# EasyEDA Pro project display_module.epro

# Schematic Schematic
Board Name: HV Display; Create Date: 2025-05-05; Page Name: P1; Project Name: HV Display; Schematic Name: Schematic; Update Date: 2025-05-05; Company: Halo Vision; Drawn: Kahu Hutton; Page Size: A4; Part Number: 002; Reviewed: Kahu Hutton; Version: V0.3
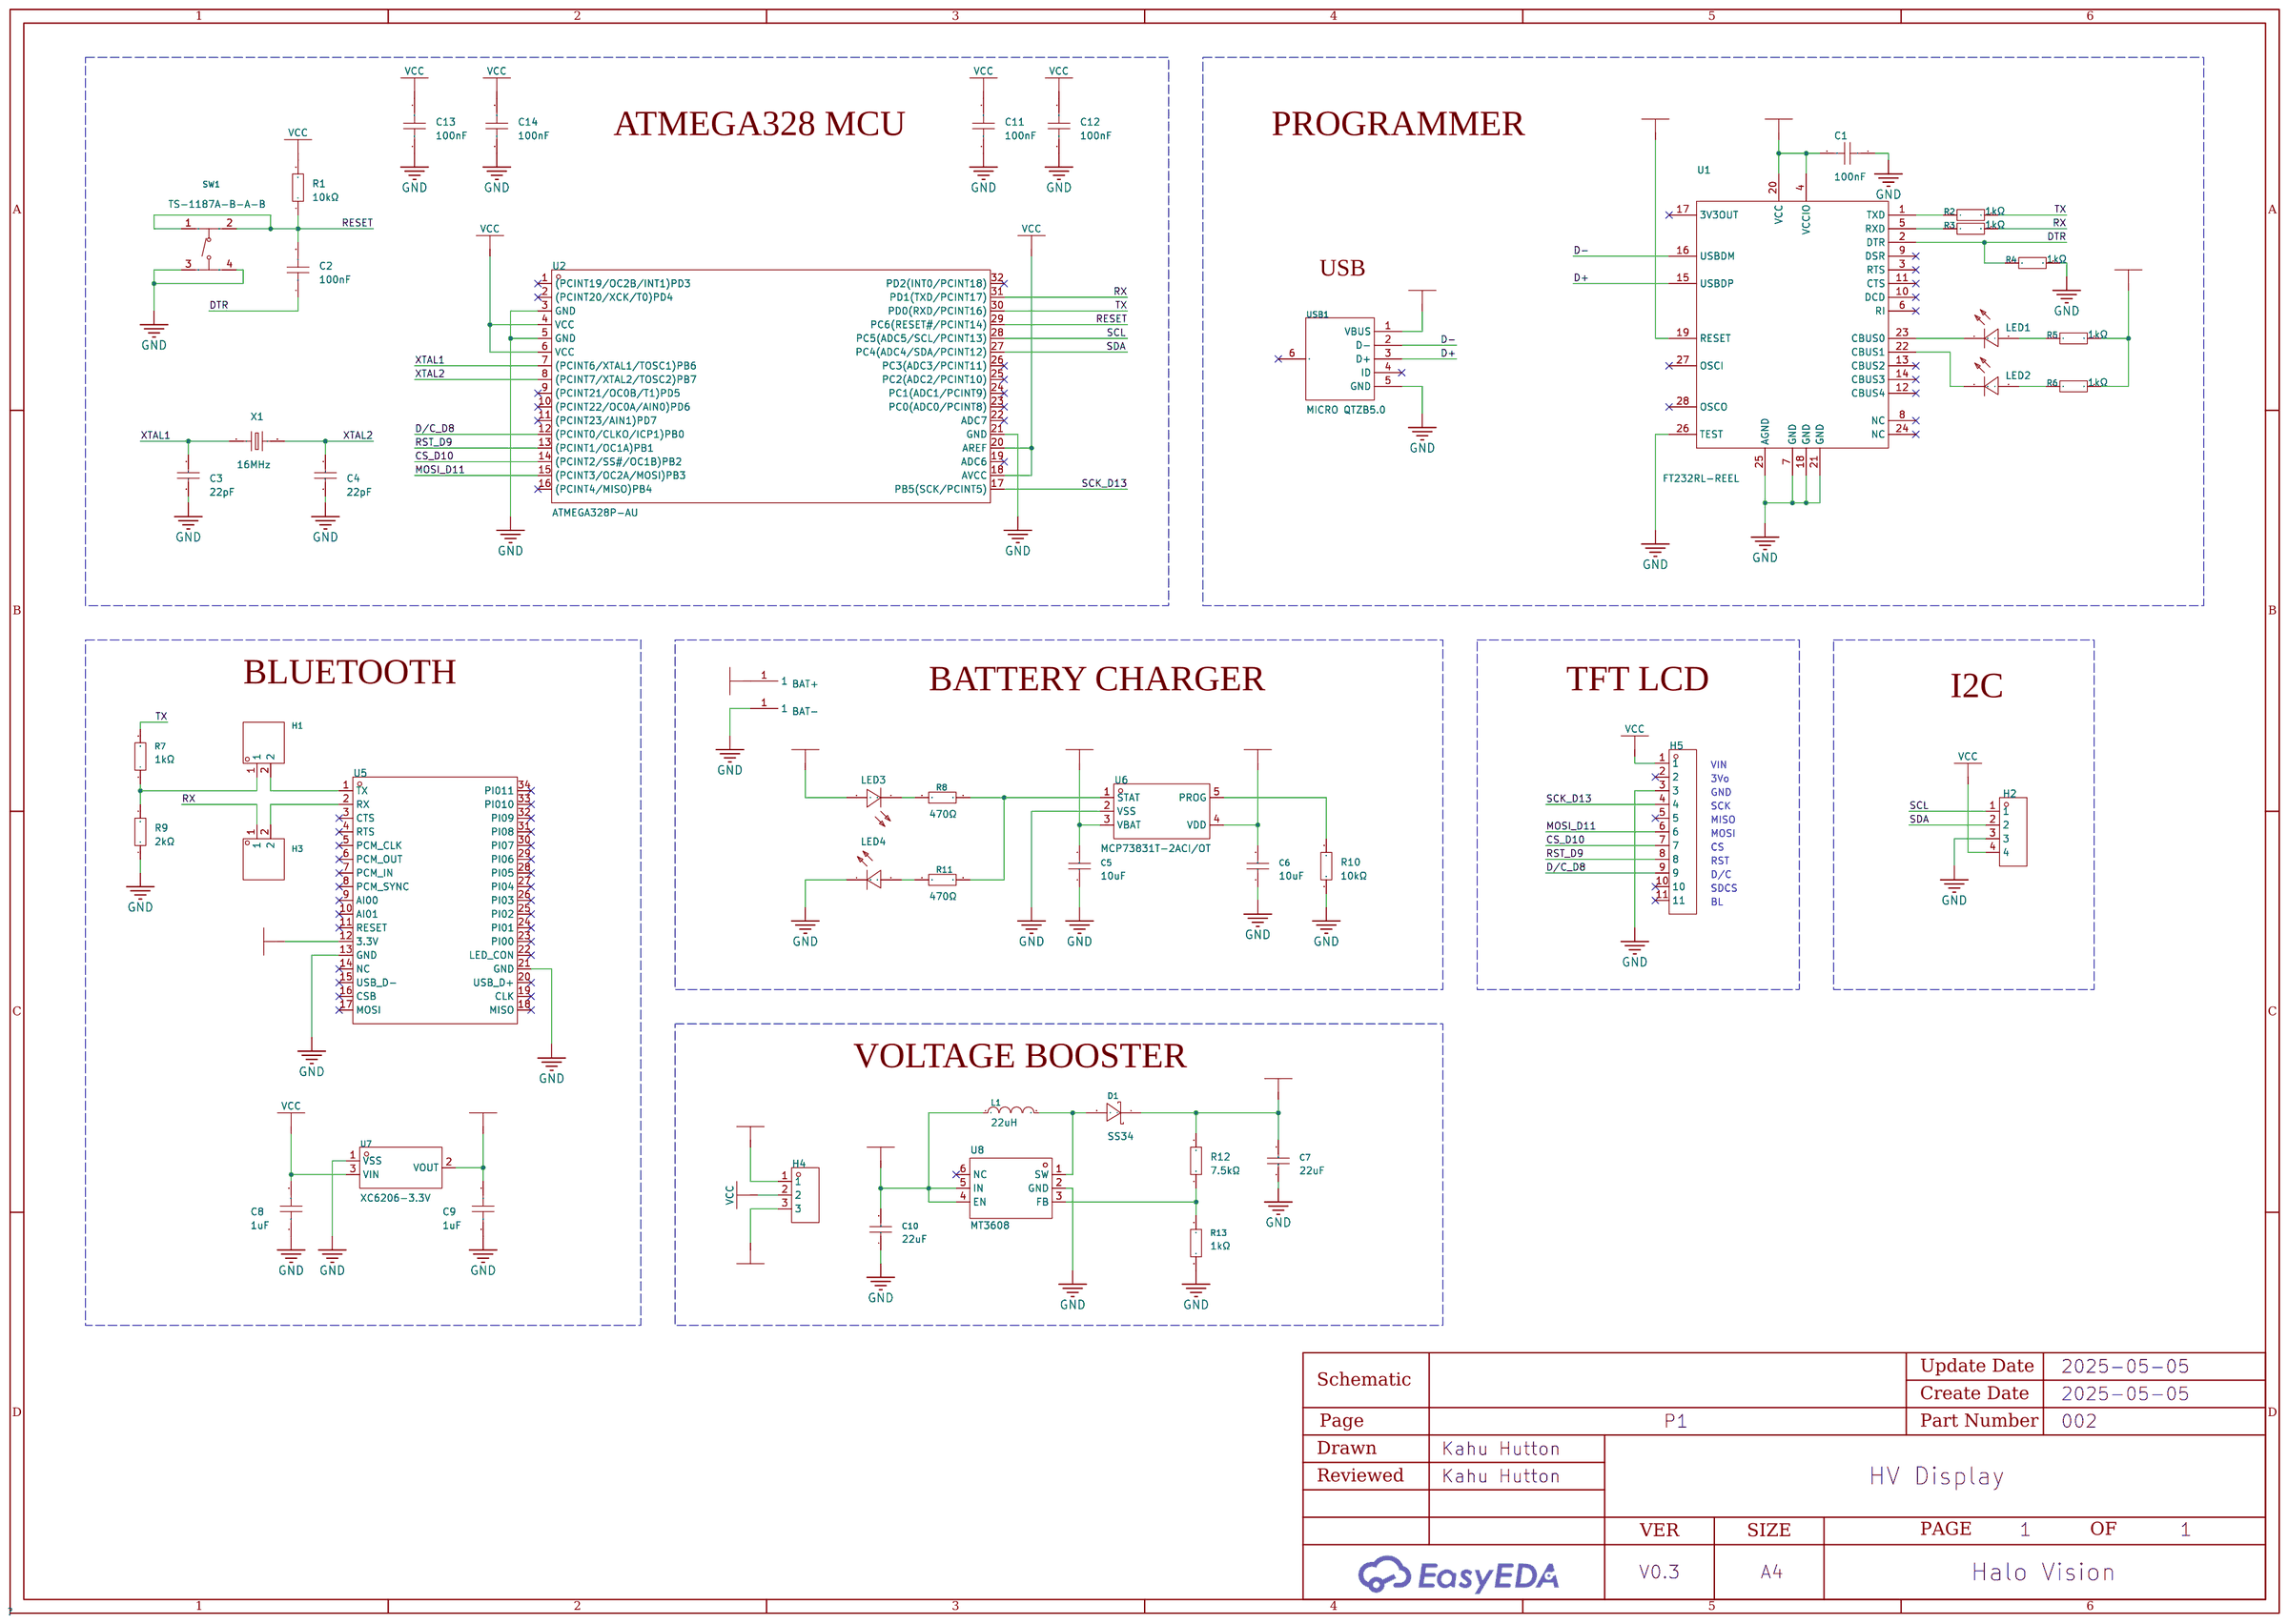
[diagram p0: schematic sheet]

## Parts
C1  100nF  [C0402]
C2  100nF  [C0402]
C3  22pF  [C0402]
C4  22pF  [C0402]
C5  10uF  [C0402]
C6  10uF  [C0402]
C7  22uF  [C1812]
C8  1uF  [C0402]
C9  1uF  [C0402]
C10  22uF  [C1812]
C11  100nF  [C0402]
C12  100nF  [C0402]
C13  100nF  [C0402]
C14  100nF  [C0402]
D1  SS34  [SMA_L4.3-W2.6-LS5.2-RD]
H1  -  [HDR-TH_2P-P2.54-V-M-1]
H2  -  [HDR-TH_4P-P2.54-V-M]
H3  -  [HDR-TH_2P-P2.54-V-M-1]
H4  -  [HDR-TH_3P-P2.54-V-M]
H5  -  [HDR-TH_11P-P2.54-V-M]
L1  22uH  [IND-SMD_L7.0-W6.8]
LED1  TJ-S1005SW4TGLC2R-A5  [LED0402-RD]
LED2  TJ-S1005SW4TGLC2R-A5  [LED0402-RD]
LED3  TJ-S1005SW4TGLC2R-A5  [LED0402-RD]
LED4  TJ-S1005SW4TGLC7K-A5  [LED0402-RD_GREEN]
R1  10kΩ  [R0402]
R2  1kΩ  [R0402]
R3  1kΩ  [R0402]
R4  1kΩ  [R0402]
R5  1kΩ  [R0402]
R6  1kΩ  [R0402]
R7  1kΩ  [R0402]
R8  470Ω  [R0402]
R9  2kΩ  [R0402]
R10  10kΩ  [R0402]
R11  470Ω  [R0402]
R12  7.5kΩ  [R0402]
R13  1kΩ  [R0402]
SW1  TS-1187A-B-A-B  [SW-SMD_4P-L5.1-W5.1-P3.70-LS6.5-TL-2]
U1  FT232RL-REEL  [SSOP-28_L10.2-W5.3-P0.65-LS7.8-BL]
U2  ATMEGA328P-AU  [TQFP-32_L7.0-W7.0-P0.80-LS9.0-BL]
U3  BAT+  [PKG-TEST-POINT-SMD_2.0X2.0]
U4  BAT-  [PKG-TEST-POINT-SMD_2.0X2.0]
U5  -  [BULETM-SMD_HC-05]
U6  MCP73831T-2ACI/OT  [SOT-23-5_L3.0-W1.7-P0.95-LS2.8-BL]
U7  XC6206-3.3V  [SSOT-3_L2.9-W1.6-P0.95-LS2.8-BR]
U8  MT3608  [SOT-23-6_L2.9-W1.6-P0.95-LS2.8-BL]
USB1  MICRO QTZB5.0  [MICRO-USB-SMD_MICRO-QTZB5.0]
X1  16MHz  [HC-49S_L11.4-W4.8]

## Library data of the parts
C1 C2 C11-C14 = CL05B104KB54PNC: Capacitance: Tolerance:±10% Tolerance:±10% Voltage Rated: Temperature Coefficient:; LCSC Part Name: 100nF ±10% 50V; Supplier Part: C307331; Manufacturer: SAMSUNG(三星); Supplier Footprint: 0402; JLCPCB Part Class: Basic Part; Datasheet: https://atta.szlcsc.com/upload/public/pdf/source/20160218/1457707763339.pdf; Supplier: LCSC; Tolerance: ±10%
C3 C4 = 0402CG220J500NT: Capacitance: Tolerance:±5% Tolerance:±5% Voltage Rated: Temperature Coefficient:; LCSC Part Name: 22pF ±5% 50V; Supplier Part: C1555; Manufacturer: FH(风华); Supplier Footprint: 0402; JLCPCB Part Class: Basic Part; Datasheet: https://atta.szlcsc.com/upload/public/pdf/source/20200305/C486355_26A10D38EF8C2A5C37091D0039909270.pdf; Supplier: LCSC; Tolerance: ±5%
C5 C6 = CL05A106MQ5NUNC: Capacitance: Tolerance:±20% Tolerance:±20% Voltage Rated: Temperature Coefficient:; LCSC Part Name: 10uF ±20% 6.3V; Supplier Part: C15525; Manufacturer: SAMSUNG(三星); Supplier Footprint: 0402; JLCPCB Part Class: Basic Part; Datasheet: https://atta.szlcsc.com/upload/public/pdf/source/20220823/2B02EE04F8F211D38A52DCB16EB6BEBA.pdf; Supplier: LCSC; Tolerance: ±20%
C7 C10 = 1812X226K250NT: Capacitance:22uF Tolerance:±10% Tolerance:±10% Voltage Rated: Temperature Coefficient:; LCSC Part Name: 22uF ±10% 25V; Supplier Part: C28504; Manufacturer: FH(风华); Supplier Footprint: 1812; JLCPCB Part Class: Extended Part; Datasheet: https://atta.szlcsc.com/upload/public/pdf/source/20200305/C486355_26A10D38EF8C2A5C37091D0039909270.pdf; Supplier: LCSC; Tolerance: ±10%
C8 C9 = CL05A105KA5NQNC: Capacitance: Tolerance:±10% Tolerance:±10% Voltage Rated: Temperature Coefficient:; LCSC Part Name: 1uF ±10% 25V; Supplier Part: C52923; Manufacturer: SAMSUNG(三星); Supplier Footprint: 0402; JLCPCB Part Class: Basic Part; Datasheet: https://atta.szlcsc.com/upload/public/pdf/source/20160218/1457707763339.pdf; Supplier: LCSC; Tolerance: ±10%
D1 = SS34_C8678: Diode Configuration:Single Forward Voltage (Vf@If):550mV@3A Reverse Voltage (Vr):40V Average Rectified Current (Io):3A Reverse Leakage Current (Ir):500uA@40V; LCSC Part Name: 电压:40V 电流:3A; Supplier Part: C8678; Manufacturer: MDD; Supplier Footprint: SMA(DO-214AC); JLCPCB Part Class: Basic Part; Datasheet: https://atta.szlcsc.com/upload/public/pdf/source/20230314/A80AE34493C69B89E2F4B1712F433538.pdf; Supplier: LCSC; Diode Configuration: Single; Forward Voltage (Vf@If): 550mV@3A; Reverse Voltage (Vr): 40V; Average Rectified Current (Io): 3A; Reverse Leakage Current (Ir): 500uA@40V
H1 H3 = HDR-M_2.54_1x2P: Supplier Footprint: Through
H2 = HDR-M_2.54_1x4P: Supplier Footprint: Through
H4 = HDR-M_2.54_1x3P: Supplier Footprint: Through
H5 = HDR-M_2.54_1x11P: Supplier Footprint: Through
L1 = SMRH74-220MT: Inductance: Tolerance:±20% Tolerance:±20% Rated Current:- Saturation Current (Isat):2.1A DC Resistance (DCR): Type:屏蔽电感; LCSC Part Name: 22uH ±20% 2.1A; Supplier Part: C27442; Manufacturer: SXN(顺翔诺); Supplier Footprint: SMD; JLCPCB Part Class: Extended Part; Datasheet: https://atta.szlcsc.com/upload/public/pdf/source/20210810/BDFBFE50B8A07C1FC066F2D9473ADCAE.pdf; Supplier: LCSC; Tolerance: ±20%; Saturation Current (Isat): 2.1A; Type: 屏蔽电感
LED1-LED3 = TJ-S1005SW4TGLC2R-A5: Emitted Color:Red; LCSC Part Name: 红灯; Supplier Part: C273598; Manufacturer: TOGIALED(统佳); Supplier Footprint: 0402; JLCPCB Part Class: Extended Part; Datasheet: https://atta.szlcsc.com/upload/public/pdf/source/20180904/C273598_1D07E90CD4668CC0D8ECC89225AAD9B4.pdf; Supplier: LCSC; Emitted Color: Red
LED4 = TJ-S1005SW4TGLC7K-A5: Emitted Color:Green-yellow; LCSC Part Name: 普绿/黄绿; Supplier Part: C273601; Manufacturer: TOGIALED(统佳); Supplier Footprint: 0402; JLCPCB Part Class: Extended Part; Datasheet: https://atta.szlcsc.com/upload/public/pdf/source/20180904/C273601_BBC7FFCC280A717DAD7A4CC4AE812583.pdf; Supplier: LCSC; Emitted Color: Green-yellow
R1 R10 = 0402WGF1002TCE: Type:Thick Film Resistors Resistance:10kΩ Tolerance:±1% Tolerance:±1% Power(Watts): Overload Voltage (Max): Temperature Coefficient:±100ppm/℃ Temperature Coefficient:±100ppm/℃ Operating Temperature Range:-55℃~+155℃ Operating Temperature Range:-55℃~+155℃; LCSC Part Name: 10kΩ ±1% 62.5mW 厚膜电阻; Supplier Part: C25744; Manufacturer: UNI-ROYAL(厚声); Supplier Footprint: 0402; JLCPCB Part Class: Basic Part; Datasheet: https://atta.szlcsc.com/upload/public/pdf/source/20200306/C422600_1E6D84923E4A46A82E41ADD87F860B5C.pdf; Supplier: LCSC; Type: Thick Film Resistors; Tolerance: ±1%; Temperature Coefficient: ±100ppm/℃; Operating Temperature Range: -55℃~+155℃
R2-R7 R13 = 0402WGF1001TCE: Type:Thick Film Resistors Resistance:1kΩ Tolerance:±1% Tolerance:±1% Power(Watts): Overload Voltage (Max): Temperature Coefficient:±100ppm/℃ Temperature Coefficient:±100ppm/℃ Operating Temperature Range:-55℃~+155℃ Operating Temperature Range:-55℃~+155℃; LCSC Part Name: 1kΩ ±1% 62.5mW 厚膜电阻; Supplier Part: C11702; Manufacturer: UNI-ROYAL(厚声); Supplier Footprint: 0402; JLCPCB Part Class: Basic Part; Datasheet: https://atta.szlcsc.com/upload/public/pdf/source/20200306/C422600_1E6D84923E4A46A82E41ADD87F860B5C.pdf; Supplier: LCSC; Type: Thick Film Resistors; Tolerance: ±1%; Temperature Coefficient: ±100ppm/℃; Operating Temperature Range: -55℃~+155℃
R8 R11 = 0402WGF4700TCE: Type:Thick Film Resistors Resistance: Tolerance:±1% Tolerance:±1% Power(Watts): Overload Voltage (Max): Temperature Coefficient:±100ppm/℃ Temperature Coefficient:±100ppm/℃ Operating Temperature Range:-55℃~+155℃ Operating Temperature Range:-55℃~+155℃; LCSC Part Name: 470Ω ±1% 62.5mW 厚膜电阻; Supplier Part: C25117; Manufacturer: UNI-ROYAL(厚声); Supplier Footprint: 0402; JLCPCB Part Class: Basic Part; Datasheet: https://atta.szlcsc.com/upload/public/pdf/source/20200306/C422600_1E6D84923E4A46A82E41ADD87F860B5C.pdf; Supplier: LCSC; Type: Thick Film Resistors; Tolerance: ±1%; Temperature Coefficient: ±100ppm/℃; Operating Temperature Range: -55℃~+155℃
R9 = 0402WGF2001TCE: Type:Thick Film Resistors Resistance: Tolerance:±1% Tolerance:±1% Power(Watts): Temperature Coefficient:±100ppm/℃ Temperature Coefficient:±100ppm/℃ Overload Voltage (Max): Operating Temperature Range:-55℃~+155℃ Operating Temperature Range:-55℃~+155℃; Supplier: LCSC; Manufacturer: UNI-ROYAL(厚声); Supplier Part: C4109; JLCPCB Part Class: Basic Part; LCSC Part Name: 厚膜电阻 2kΩ ±1% 62.5mW; Supplier Footprint: 0402; Datasheet: https://atta.szlcsc.com/upload/public/pdf/source/20200306/C422600_1E6D84923E4A46A82E41ADD87F860B5C.pdf; Type: Thick Film Resistors; Tolerance: ±1%; Temperature Coefficient: ±100ppm/℃; Operating Temperature Range: -55℃~+155℃
R12 = WR04X7501FTL: Type:Thick Film Resistors Resistance: Tolerance:±1% Tolerance:±1% Power(Watts): Overload Voltage (Max): Temperature Coefficient:±100ppm/℃ Temperature Coefficient:±100ppm/℃ Operating Temperature Range:-55℃~+155℃ Operating Temperature Range:-55℃~+155℃; LCSC Part Name: 厚膜电阻 7.5kΩ ±1% 62.5mW; Supplier Part: C168247; Manufacturer: Walsin(华新科); Supplier Footprint: 0402; JLCPCB Part Class: Extended Part; Datasheet: https://atta.szlcsc.com/upload/public/pdf/source/20191217/C470037_D99261402F77DA8B1D609223749D445A.pdf; Supplier: LCSC; Type: Thick Film Resistors; Tolerance: ±1%; Temperature Coefficient: ±100ppm/℃; Operating Temperature Range: -55℃~+155℃
SW1 = TS-1187A-B-A-B: Circuit:SPST Actuator Style:Round Button Operating Force:160gf Mounting Style:Brick nogging Switch Length:5.1mm Switch Width:5.1mm Switch Height:1.5mm Strike Gundam:不带 Contact Current:50mA Voltage Rating (DC):12V Insulation Resistance:- Actuator/Cap Color; LCSC Part Name: 5.1*5.1*1.5mm 立贴 轻触开关; Supplier Part: C318884; Manufacturer: XKB Connectivity(中国星坤); Supplier Footprint: SMD; JLCPCB Part Class: Basic Part; Datasheet: https://atta.szlcsc.com/upload/public/pdf/source/20200227/C318890_053E50208A88A7BA1965D8746000774E.pdf; Supplier: LCSC; Circuit: SPST; Actuator Style: Round Button; Operating Force: 160gf; Mounting Style: Brick nogging; Switch Length: 5.1mm; Switch Width: 5.1mm; Switch Height: 1.5mm; Strike Gundam: 不带; Contact Current: 50mA; Voltage Rating (DC): 12V; Actuator/Cap Color: 金色; With Lamp: No; Mechanical Life: 10万次; Operating Temperature: -30℃~+85℃
U1 = FT232RL-REEL: Applications Function:USB转UART Protocol:UART Supply Voltage:3.3V~5.25V Supply Voltage:3.3V~5.25V Operating Temperature:-40℃~+85℃ Operating Temperature:-40℃~+85℃; LCSC Part Name: USB UART IC; Supplier Part: C8690; Manufacturer: FTDI(飞特帝亚); Supplier Footprint: SSOP-28-208mil; JLCPCB Part Class: Extended Part; Datasheet: https://atta.szlcsc.com/upload/public/pdf/source/20130221/1457706592200.pdf; Supplier: LCSC; Applications Function: USB转UART; Protocol: UART; Supply Voltage: 3.3V~5.25V; Operating Temperature: -40℃~+85℃
U2 = ATMEGA328P-AU_C14877: CPU Core:AVR Program Storage Size:32KB RAM Size:2KB GPIO Ports Number:23 Operating Voltage Range:1.8V~5.5V Operating Voltage Range:1.8V~5.5V CPU Maximum Speed:20MHz Program Memory Type:FLASH EEPROM:1KB Operating Temperature Range:-40℃~+85℃ Operating Tempe; LCSC Part Name: 基于AVR增强型RISC架构的低功耗CMOS 8位微控制器; Supplier Part: C14877; Manufacturer: MICROCHIP(美国微芯); Supplier Footprint: TQFP-32(7x7); JLCPCB Part Class: Extended Part; Datasheet: https://atta.szlcsc.com/upload/public/pdf/source/20140621/1457707095197.pdf; Supplier: LCSC; CPU Core: AVR; Program Storage Size: 32KB; RAM Size: 2KB; GPIO Ports Number: 23; Operating Voltage Range: 1.8V~5.5V; CPU Maximum Speed: 20MHz; Program Memory Type: FLASH; EEPROM: 1KB; Operating Temperature Range: -40℃~+85℃; ADC (Bit): 10bit; Peripheral/Function: WDT；PWM；WDT；PWM; Watchdog: 有; Low-Voltage Detect: 有; Internal Oscillator: 有
U3 U4 = TP-黑色测试点: Supplier Part: C9900007426; Supplier Footprint: TESTPOINT-TH_BD-2P-P2.00; JLCPCB Part Class: Extended Part; Supplier: LCSC
U5 = HC-05: Supplier Part: C9900001063; Supplier Footprint: SMD-34_13.0X27.0X1.50P; JLCPCB Part Class: 扩展库; Datasheet: 2021-10-26/262798S/0744a6e575994a8186035cee355055ea/HC-05.pdf; Supplier: LCSC
U6 = MCP73831T-2ACI/OT: Supply Voltage:6V Supply Voltage:6V Maximum Charge Current:500mA Type of Battery:锂离子/Polymer Number of Cells:1 Number of Cells:1 Operating Temperature:-40℃~+85℃ Operating Temperature:-40℃~+85℃; Supplier Part: C424093; Manufacturer: MICROCHIP(美国微芯); Supplier Footprint: SOT-23-5; JLCPCB Part Class: Extended Part; Datasheet: https://atta.szlcsc.com/upload/public/pdf/source/20190902/C424093_BB3CBFD6F009A8554318004A07DA97EE.pdf; Supplier: LCSC; Supply Voltage: 6V; Maximum Charge Current: 500mA; Type of Battery: 锂离子/Polymer; Number of Cells: 1; Operating Temperature: -40℃~+85℃
U7 = XC6206-3.3V_C2891841: Output Type: Maximum Input Voltage:6V Output Voltage:3.3V Output Voltage:3.3V MAX Output Current:250mA Operating Temperature:-40℃~+85℃@(Tj) Operating Temperature:-40℃~+85℃@(Tj) Output Polarity:Positive electrode Number of Outputs:1; LCSC Part Name: 输入6V 输出3.3V 250mA; Supplier Part: C2891841; Manufacturer: YONGYUTAI(永裕泰); Supplier Footprint: SOT-23-3L; JLCPCB Part Class: Extended Part; Datasheet: https://atta.szlcsc.com/upload/public/pdf/source/20210901/DE3C77F0CE73FFE8F7C655BE9B94CB06.pdf; Supplier: LCSC; Maximum Input Voltage: 6V; Output Voltage: 3.3V; MAX Output Current: 250mA; Operating Temperature: -40℃~+85℃@(Tj); Output Polarity: Positive electrode; Number of Outputs: 1
U8 = MT3608: Function:boost converterType Input Voltage:2V~24V Input Voltage:2V~24V Output Voltage:28V Output Voltage:28V Output Current (Max):- Switching Frequency:1.2MHz Synchronous Rectification:- Number of Outputs:1 Topology:Boost Switch tube (built-in/external):内; Supplier Part: C84817; Manufacturer: 西安航天民芯; Supplier Footprint: SOT-23-6; JLCPCB Part Class: Extended Part; Datasheet: https://atta.szlcsc.com/upload/public/pdf/source/20161110/1478743351706.pdf; Supplier: LCSC; Function: boost converterType; Input Voltage: 2V~24V; Output Voltage: 28V; Switching Frequency: 1.2MHz; Number of Outputs: 1; Topology: Boost; Switch tube (built-in/external): 内置
USB1 = MICRO QTZB5.0: Connector Type:Micro-B Standard:USB 2.0 Gender:Female Number of Ports:1 Number of Contacts:5P Mounting Style:卧贴 Current Rating - Power (Max):1A Operating Temperature Range:-30℃~+80℃ Operating Temperature Range:-30℃~+80℃; LCSC Part Name: Micro-B 母 卧贴; Supplier Part: C2681556; Manufacturer: SHOU HAN(首韩); Supplier Footprint: SMD; JLCPCB Part Class: Extended Part; Datasheet: https://atta.szlcsc.com/upload/public/pdf/source/20210107/C2681556_CFA58CC35A80C3AC7F409A47931A5E57.pdf; Supplier: LCSC; Connector Type: Micro-B; Standard: USB 2.0; Gender: Female; Number of Ports: 1; Number of Contacts: 5P; Mounting Style: 卧贴; Current Rating - Power (Max): 1A; Operating Temperature Range: -30℃~+80℃
X1 = TAXM16M2GLFBET2T: Crystal Type:贴片晶振 Frequency: Normal temperature Frequency Tolerance:±30ppm Normal temperature Frequency Tolerance:±30ppm External load capacitor: Frequency Stability(Full temperature range):±30ppm Frequency Stability(Full temperature range):±30ppm Equival; LCSC Part Name: 16MHz ±30ppm 20pF; Supplier Part: C111377; Manufacturer: YJX(雅晶鑫); Supplier Footprint: HC-49S-SMD; JLCPCB Part Class: Extended Part; Datasheet: https://atta.szlcsc.com/upload/public/pdf/source/20190305/C362352_AFD953984E9CF948957766F91AB56AA4.pdf; Supplier: LCSC; Crystal Type: 贴片晶振; Normal temperature Frequency Tolerance: ±30ppm; Frequency Stability(Full temperature range): ±30ppm; Equivalent Series Resistance (ESR): 50Ω

## Nets
5V_BOOST: C7.2 D1.1(K) H4.3 R12.2
+3V3: C9.2 U5.12(3.3V) U7.2(VOUT)
GND: C1.1 C3.1 C4.1 C5.1 C6.1 C7.1 C8.1 C9.1 C10.1 C11.1 C12.1 C13.1 C14.1 H2.3 H5.3 LED4.1(C) R4.2 R9.1 R10.1 R13.1 SW1.3(C) SW1.4(D) U1.7(GND) U1.18(GND) U1.21(GND) U1.25(AGND) U1.26(TEST) U2.3(GND) U2.5(GND) U2.21(GND) U4.1 U5.13(GND) U5.21(GND) U6.2(VSS) U7.1(VSS) U8.2(GND) USB1.5(GND)
VBAT: C5.2 C10.2 L1.1 U3.1 U6.3(VBAT) U8.4(EN) U8.5(IN)
VBUS: C1.2 C6.2 H4.1 LED3.2(A) R5.2 R6.2 U1.4(VCCIO) U1.19(RESET) U1.20(VCC) U6.4(VDD) USB1.1(VBUS)
VCC: C8.2 C11.2 C12.2 C13.2 C14.2 H2.4 H4.2 H5.1 R1.2 U2.4(VCC) U2.6(VCC) U2.18(AVCC) U2.20(AREF) U7.3(VIN)
CS_D10: H5.7 U2.14((PCINT2/SS#/OC1B)PB2)
D+: U1.15(USBDP) USB1.3(D+)
D-: U1.16(USBDM) USB1.2(D-)
D/C_D8: H5.9 U2.12((PCINT0/CLKO/ICP1)PB0)
DTR: C2.1 R4.1 U1.2(DTR)
MOSI_D11: H5.6 U2.15((PCINT3/OC2A/MOSI)PB3)
RESET: C2.2 R1.1 SW1.1(A) SW1.2(B) U2.29(PC6(RESET#/PCINT14))
RST_D9: H5.8 U2.13((PCINT1/OC1A)PB1)
RX: H3.1 R3.2 U2.31(PD1(TXD/PCINT17))
SCK_D13: H5.4 U2.17(PB5(SCK/PCINT5))
SCL: H2.1 U2.28(PC5(ADC5/SCL/PCINT13))
SDA: H2.2 U2.27(PC4(ADC4/SDA/PCINT12))
TX: R2.2 R7.2 U2.30(PD0(RXD/PCINT16))
XTAL1: C3.2 U2.7((PCINT6/XTAL1/TOSC1)PB6) X1.1
XTAL2: C4.2 U2.8((PCINT7/XTAL2/TOSC2)PB7) X1.2
Net-(D1-2): D1.2(A) L1.2 U8.1(SW)
Net-(H1-1): H1.1 R7.1 R9.2
Net-(H1-2): H1.2 U5.1(TX)
Net-(H3-2): H3.2 U5.2(RX)
Net-(LED1-1): LED1.1(C) U1.23(CBUS0)
Net-(LED1-2): LED1.2(A) R5.1
Net-(LED2-1): LED2.1(C) U1.22(CBUS1)
Net-(LED2-2): LED2.2(A) R6.1
Net-(LED3-1): LED3.1(C) R8.1
Net-(LED4-2): LED4.2(A) R11.1
Net-(R2-1): R2.1 U1.1(TXD)
Net-(R3-1): R3.1 U1.5(RXD)
Net-(R8-2): R8.2 R11.2 U6.1(STAT)
Net-(R10-2): R10.2 U6.5(PROG)
Net-(R12-1): R12.1 R13.2 U8.3(FB)

Not connected (* = marked no-connect by the designer): H5 2* 5* 10* 11*; U1 3(RTS)* 6(RI)* 8(NC)* 9(DSR)* 10(DCD)* 11(CTS)* 12(CBUS4)* 13(CBUS2)* 14(CBUS3)* 17(3V3OUT)* 24(NC)* 27(OSCI)* 28(OSCO)*; U2 1((PCINT19/OC2B/INT1)PD3)* 2((PCINT20/XCK/T0)PD4)* 9((PCINT21/OC0B/T1)PD5)* 10((PCINT22/OC0A/AIN0)PD6)* 11((PCINT23/AIN1)PD7)* 16((PCINT4/MISO)PB4)* 19(ADC6)* 22(ADC7)* 23(PC0(ADC0/PCINT8))* 24(PC1(ADC1/PCINT9))* 25(PC2(ADC2/PCINT10))* 26(PC3(ADC3/PCINT11))* 32(PD2(INT0/PCINT18))*; U5 3(CTS)* 4(RTS)* 5(PCM_CLK)* 6(PCM_OUT)* 7(PCM_IN)* 8(PCM_SYNC)* 9(AI00)* 10(AI01)* 11(RESET)* 14(NC)* 15(USB_D-)* 16(CSB)* 17(MOSI)* 18(MISO)* 19(CLK)* 20(USB_D+)* 22(LED_CON)* 23(PI00)* 24(PI01)* 25(PI02)* 26(PI03)* 27(PI04)* 28(PI05)* 29(PI06)* 30(PI07)* 31(PI08)* 32(PI09)* 33(PI010)* 34(PI011)*; U8 6(NC)*; USB1 4(ID)* 6(EH)*

## Notes on the sheet
- ATMEGA328 MCU
- PROGRAMMER
- USB
- BLUETOOTH
- BATTERY CHARGER
- TFT LCD
- I2C
- VIN
- 3Vo
- GND
- MISO
- SCK
- MOSI
- CS
- RST
- D/C
- BL
- SDCS
- VOLTAGE BOOSTER
